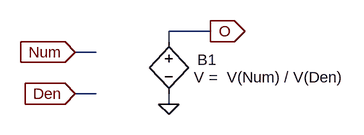
[diagram p0: schematic divider_module.asc]
divider_module.asc, the LTspice schematic file:
Version 4
SHEET 1 880 680
WIRE 240 160 176 160
WIRE 176 176 176 160
WIRE 64 192 32 192
WIRE 64 256 32 256
WIRE 176 272 176 256
FLAG 32 192 Num
IOPIN 32 192 In
FLAG 32 256 Den
IOPIN 32 256 In
FLAG 176 272 0
FLAG 240 160 O
IOPIN 240 160 Out
SYMBOL bv 176 160 R0
WINDOW 0 44 44 Left 0
WINDOW 3 39 71 Left 0
SYMATTR InstName B1
SYMATTR Value V =  V(Num) / V(Den)

The netlist it stands for:
* divider_module.asc
B1 O 0 V =  V(Num) / V(Den)
.backanno
.end